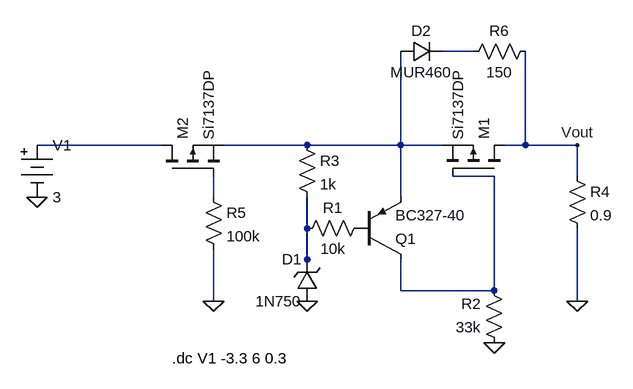
[diagram p0: schematic overvoltage_protection.asc]
overvoltage_protection.asc, the LTspice schematic file:
Version 4
SHEET 1 880 680
WIRE 352 -128 304 -128
WIRE -128 16 -320 16
WIRE 96 16 -32 16
WIRE 240 16 240 -128
WIRE 240 16 96 16
WIRE 304 16 240 16
WIRE 432 16 432 -128
WIRE 432 16 400 16
WIRE 512 16 432 16
WIRE 384 64 320 64
WIRE 512 64 512 16
WIRE -48 96 -48 64
WIRE 240 96 240 16
WIRE 96 144 96 96
WIRE 96 192 96 144
WIRE 96 208 96 192
WIRE 240 240 240 192
WIRE 384 240 384 64
WIRE 384 240 240 240
WIRE -48 256 -48 176
WIRE 512 256 512 144
FLAG 384 320 0
FLAG 96 256 0
FLAG 512 16 Vout
FLAG 512 256 0
FLAG -48 256 0
FLAG -320 96 0
SYMBOL pnp 176 192 M180
SYMATTR InstName Q1
SYMATTR Value BC327-40
SYMBOL res 192 128 R90
WINDOW 0 0 56 VBottom 2
WINDOW 3 32 56 VTop 2
SYMATTR InstName R1
SYMATTR Value 10k
SYMBOL res 400 336 R180
WINDOW 0 36 76 Left 2
WINDOW 3 36 40 Left 2
SYMATTR InstName R2
SYMATTR Value 33k
SYMBOL zener 112 256 R180
WINDOW 0 24 64 Left 2
WINDOW 3 24 0 Left 2
SYMATTR InstName D1
SYMATTR Value 1N750
SYMATTR Description Diode
SYMATTR Type diode
SYMBOL res 80 0 R0
SYMATTR InstName R3
SYMATTR Value 1k
SYMBOL pmos 400 64 M270
SYMATTR InstName M1
SYMATTR Value Si7137DP
SYMBOL res 496 48 R0
SYMATTR InstName R4
SYMATTR Value 0.9
SYMBOL pmos -128 64 R270
SYMATTR InstName M2
SYMATTR Value Si7137DP
SYMBOL res -64 80 R0
SYMATTR InstName R5
SYMATTR Value 100k
SYMBOL Misc\\battery -320 0 R0
SYMATTR InstName V1
SYMATTR Value 3
SYMBOL diode 240 -112 R270
WINDOW 0 32 32 VTop 2
WINDOW 3 0 32 VBottom 2
SYMATTR InstName D2
SYMATTR Value MUR460
SYMBOL res 448 -144 R90
WINDOW 0 0 56 VBottom 2
WINDOW 3 32 56 VTop 2
SYMATTR InstName R6
SYMATTR Value 150
TEXT -112 344 Left 2 !.dc V1 -3.3 6 0.3

The netlist it stands for:
* overvoltage_protection.asc
Q1 N004 P001 N003 0 BC327-40
R1 P001 N006 10k
R2 0 N004 33k
D1 0 N006 1N750
R3 N003 N006 1k
M1 Vout N004 N003 N003 Si7137DP
R4 Vout 0 0.9
M2 N002 N005 N003 N003 Si7137DP
R5 N005 0 100k
V1 N002 0 3
D2 N003 N001 MUR460
R6 Vout N001 150
.model D D
.lib standard.dio
.model NPN NPN
.model PNP PNP
.lib standard.bjt
.model NMOS NMOS
.model PMOS PMOS
.lib standard.mos
.dc V1 -3.3 6 0.3
.backanno
.end